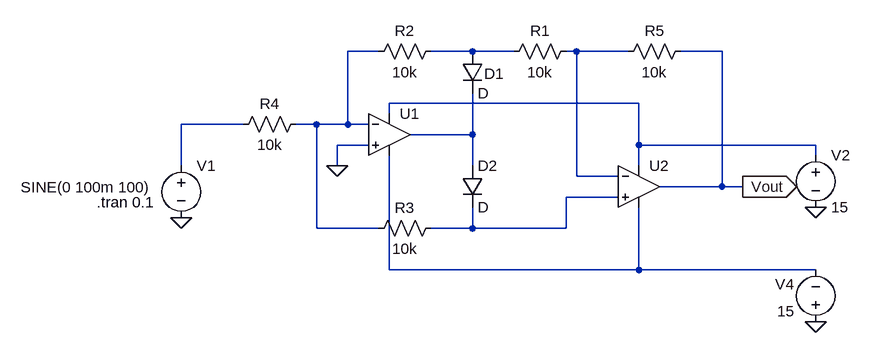
[diagram p0: schematic Full_Wave_Rectifier.asc]
Full_Wave_Rectifier.asc, the LTspice schematic file:
Version 4
SHEET 1 888 680
WIRE 160 -48 112 -48
WIRE 304 -48 240 -48
WIRE 368 -48 304 -48
WIRE 464 -48 448 -48
WIRE 544 -48 464 -48
WIRE 688 -48 624 -48
WIRE 560 32 176 32
WIRE 176 48 176 32
WIRE -48 64 -144 64
WIRE 64 64 32 64
WIRE 112 64 112 -48
WIRE 112 64 64 64
WIRE 144 64 112 64
WIRE 304 80 304 16
WIRE 304 80 208 80
WIRE 144 96 96 96
WIRE 560 96 560 32
WIRE 832 96 560 96
WIRE 832 112 832 96
WIRE -144 128 -144 64
WIRE 96 128 96 96
WIRE 304 128 304 80
WIRE 560 128 560 96
WIRE 464 144 464 -48
WIRE 528 144 464 144
WIRE 688 160 688 -48
WIRE 688 160 592 160
WIRE 720 160 688 160
WIRE 528 176 448 176
WIRE 64 224 64 64
WIRE 160 224 64 224
WIRE 304 224 304 192
WIRE 304 224 240 224
WIRE 448 224 448 176
WIRE 448 224 304 224
WIRE 176 288 176 112
WIRE 560 288 560 192
WIRE 560 288 176 288
WIRE 832 288 560 288
FLAG 832 368 0
FLAG 832 192 0
FLAG 96 128 0
FLAG -144 208 0
FLAG 720 160 Vout
IOPIN 720 160 Out
SYMBOL diode 288 -48 R0
WINDOW 0 34 34 Left 2
SYMATTR InstName D1
SYMBOL diode 288 128 R0
SYMATTR InstName D2
SYMBOL res 464 -64 R90
WINDOW 0 0 56 VBottom 2
WINDOW 3 32 56 VTop 2
SYMATTR InstName R1
SYMATTR Value 10k
SYMBOL res 256 -64 R90
WINDOW 0 0 56 VBottom 2
WINDOW 3 32 56 VTop 2
SYMATTR InstName R2
SYMATTR Value 10k
SYMBOL res 256 208 R90
WINDOW 0 0 56 VBottom 2
WINDOW 3 32 56 VTop 2
SYMATTR InstName R3
SYMATTR Value 10k
SYMBOL res 48 48 R90
WINDOW 0 0 56 VBottom 2
WINDOW 3 32 56 VTop 2
SYMATTR InstName R4
SYMATTR Value 10k
SYMBOL res 640 -64 R90
WINDOW 0 0 56 VBottom 2
WINDOW 3 32 56 VTop 2
SYMATTR InstName R5
SYMATTR Value 10k
SYMBOL voltage -144 112 R0
WINDOW 3 -247 49 Left 2
WINDOW 123 0 0 Left 0
WINDOW 39 0 0 Left 0
SYMATTR InstName V1
SYMATTR Value SINE(0 100m 100)
SYMBOL voltage 832 96 R0
WINDOW 123 0 0 Left 0
WINDOW 39 0 0 Left 0
SYMATTR InstName V2
SYMATTR Value 15
SYMBOL voltage 832 384 R180
WINDOW 0 33 74 Left 2
WINDOW 3 32 32 Left 2
WINDOW 123 0 0 Left 0
WINDOW 39 0 0 Left 0
SYMATTR InstName V4
SYMATTR Value 15
SYMBOL OpAmps\\UniversalOpamp2 176 80 R0
SYMATTR InstName U1
SYMBOL OpAmps\\UniversalOpamp2 560 160 R0
SYMATTR InstName U2
TEXT -274 184 Left 2 !.tran 0.1

The netlist it stands for:
* Full_Wave_Rectifier.asc
D1 N002 N006 D
D2 N006 N007 D
R1 N003 N002 10k
R2 N002 N001 10k
R3 N007 N001 10k
R4 N001 N005 10k
R5 Vout N003 10k
V1 N005 0 SINE(0 100m 100)
V2 N004 0 15
V4 0 N008 15
XU1 0 N001 N004 N008 N006 level.2 Avol=1Meg GBW=10Meg Slew=10Meg ilimit=25m rail=0 Vos=0 phimargin=45 en=0 enk=0 in=0 ink=0 Rin=500Meg  ; pins IN+ IN- V+ V- OUT
XU2 N007 N003 N004 N008 Vout level.2 Avol=1Meg GBW=10Meg Slew=10Meg ilimit=25m rail=0 Vos=0 phimargin=45 en=0 enk=0 in=0 ink=0 Rin=500Meg  ; pins IN+ IN- V+ V- OUT
.model D D
.lib standard.dio
.tran 0.1
.lib UniversalOpamps2.sub
.backanno
.end